# Altium schematic sheet Power and system. Page 5.SchDoc
size 420 x 297 mm; Address1: Address1; Address2: Address2; Address3: Address3; Address4: Address4; DocumentNumber: АБВГ.123456.001 Э3; SheetNumber: 5; SheetTotal: 5; Scale: 1:1; DocumentType: Схема электрическая принципиальная; FirstReferrence: АБВГ.123456.001
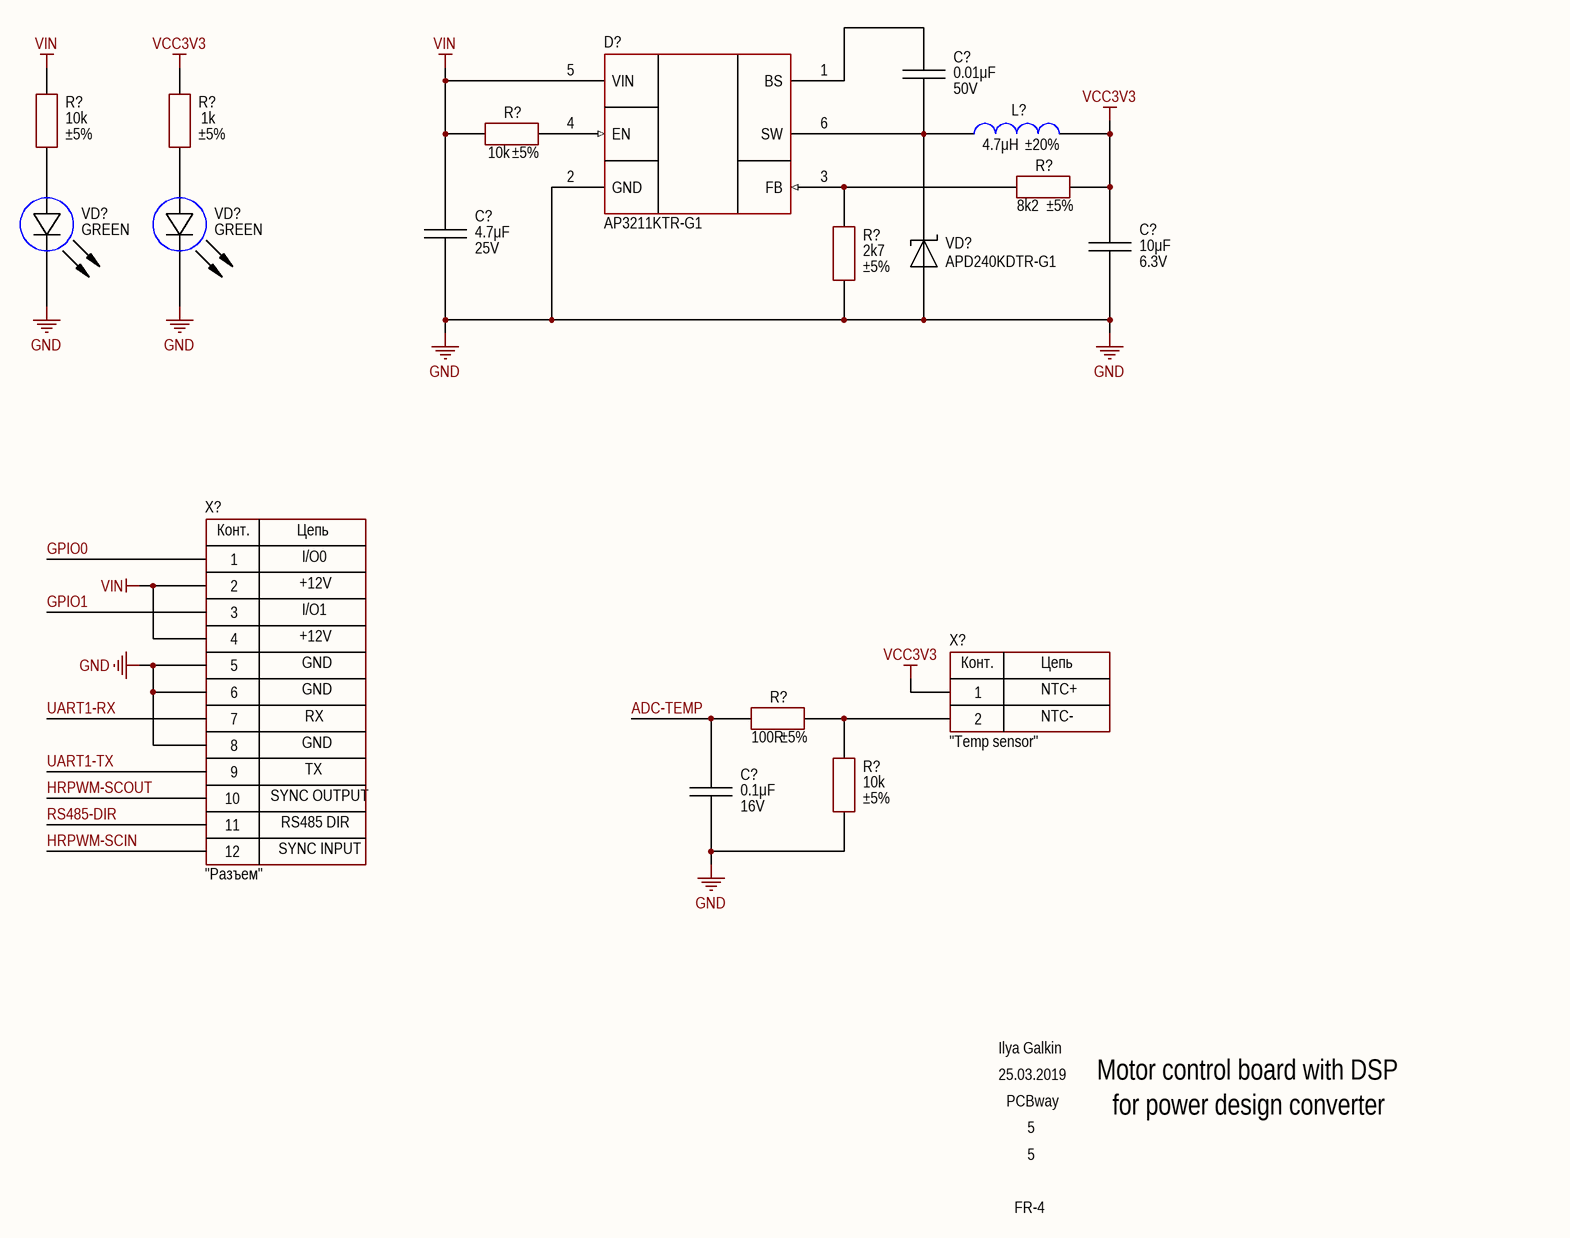
[diagram p0: Power and system. Page 5.SchDoc]

## Parts
(Parts that share a designator on the sheet are numbered #1, #2 ... from top to bottom, then left to right.)
C?#1  value 0.01μF  Voltage: 50V  [CAP: 0805]
C?#2  value 4.7μF  Voltage: 25V  [CAP: 0805]
C?#3  value 10μF  Voltage: 6.3V  [CAP: 0805]
C?#4  value 0.1μF  Voltage: 16V  [CAP: 0805]
D?  (no value)  [SOT23-6]
L?  value 4.7μH  Tolerance: ±20%  [IND: SRP2510A]
R?#1  value 10k  Tolerance: ±5%  [RES: 0805]
R?#2  value 10k  Tolerance: ±5%  [RES: 0805]
R?#3  value 1k  Tolerance: ±5%  [RES: 0805]
R?#4  value 8k2  Tolerance: ±5%  [RES: 0805]
R?#5  value 2k7  Tolerance: ±5%  [RES: 0805]
R?#6  value 100R  Tolerance: ±5%  [RES: 0805]
R?#7  value 10k  Tolerance: ±5%  [RES: 0805]
VD?#1  Color: GREEN  [LED: 0603G]
VD?#2  Color: GREEN  [LED: 0603G]
VD?#3  PartNumber: APD240KDTR-G1  [DIODE: SOD123]
X?#1  CommentText: "Разъем"  [CON: PBD-12]
X?#2  CommentText: "Temp sensor"  [CON: PLS-2]

## Nets
GND: C?#2.1 C?#3.1 C?#4.1 D?.2(GND) R?#5.1 R?#7.1 VD?#1.2(C) VD?#2.2(C) VD?#3.1 X?#1.5 X?#1.6 X?#1.8
VCC3V3: C?#3.2 L?.1 R?#3.2 R?#4.2 X?#2.1
VIN: C?#2.2 D?.5(VIN) R?#1.1 R?#2.2 X?#1.2 X?#1.4
ADC-TEMP: C?#4.2 R?#6.1
GPIO0: X?#1.1
GPIO1: X?#1.3
HRPWM-SCIN: X?#1.12
HRPWM-SCOUT: X?#1.10
RS485-DIR: X?#1.11
UART1-RX: X?#1.7
UART1-TX: X?#1.9
NetC?#1_1: C?#1.1 D?.6(SW) L?.2 VD?#3.2
NetC?#1_2: C?#1.2 D?.1(BS)
NetD?_3: D?.3(FB) R?#4.1 R?#5.2
NetD?_4: D?.4(EN) R?#1.2
NetR?#2_1: R?#2.1 VD?#1.1(A)
NetR?#3_1: R?#3.1 VD?#2.1(A)
NetR?#6_2: R?#6.2 R?#7.2 X?#2.2

## Notes on the sheet
- +12V
- I/O0
- GND
- I/O1
- RX
- NTC+
- NTC-
- SYNC OUTPUT
- TX
- SYNC INPUT
- RS485 DIR
- Ilya Galkin
- 25.03.2019
- PCBway
- 5
- Motor control board with DSP
- for power design converter
- FR-4
- Author
- Manufacturer
- Date
- Page
- Total pages
- Size page
- A3
- Open Hardware Project
- Materials
- (in symbol PBD-12) Конт.; Цепь
- (in symbol PLS-2) Конт.; Цепь

## Library data of the parts
C?#1 = Ceramic_0805: Manufacturer: Yageo; PartNumber: CC0805KRX7R9BB103; ValueManufacturerPartNumber: Ceramic capacitor, 0.01μF, X7R, ±10%, 50V, 0805, -55...+125°C; TypeCapacitor: Ceramic capacitor; Tolerance: ±10%; TypeDielectric: X7R; Package: 0805; HelpURL: https://www.digikey.com/product-detail/en/yageo/CC0805KRX7R9BB103/311-1136-1-ND/303046; Temperature: -55...+125°C
C?#2 = Ceramic_0805: Manufacturer: Samsung; PartNumber: CL21B475KAFNNNE; ValueManufacturerPartNumber: Ceramic capacitor, 4.7μF, X7R, ±10%, 25V, 0805, -55...+125°C; TypeCapacitor: Ceramic capacitor; Tolerance: ±10%; TypeDielectric: X7R; Package: 0805; HelpURL: https://www.digikey.com/product-detail/en/samsung-electro-mechanics/CL21B475KAFNNNE/1276-2969-1-ND/3891055; Temperature: -55...+125°C
C?#3 = Ceramic_0805: Manufacturer: Samsung; PartNumber: CL21B106KQQNNNE; ValueManufacturerPartNumber: Ceramic capacitor, 10μF, X7R, ±10%, 6.3V, 0805, -55...+125°C; TypeCapacitor: Ceramic capacitor; Tolerance: ±10%; TypeDielectric: X7R; Package: 0805; HelpURL: https://www.digikey.com/product-detail/en/samsung-electro-mechanics/CL21B106KQQNNNE/1276-1113-1-ND/3889199; Temperature: -55...+125°C
C?#4 = Ceramic_0805: Manufacturer: Yageo; PartNumber: CC0805KRX7R7BB104; ValueManufacturerPartNumber: Ceramic capacitor, 0.1μF, X7R, ±10%, 16V, 0805, -55...+125°C; TypeCapacitor: Ceramic capacitor; Tolerance: ±10%; TypeDielectric: X7R; Package: 0805; HelpURL: https://www.digikey.com/product-detail/en/yageo/CC0805KRX7R7BB104/311-1142-1-ND/303052; Temperature: -55...+125°C
D? = AP3211KTR-G1: Buck converter; Manufacturer: Diodes Incorporated; ValueManufacturerPartNumber: DC/DC buck converter, input 4.5...18V, 1.4MHz, output 0.81...15V, 1.5A, -40...+85°C, SOT23-6; VoltageInput: input 4.5...18V; Frequency: 1.4MHz; CurrentOutput: 1.5A; VoltageOutput: output 0.81...15V; HelpURL: https://www.digikey.com/product-detail/en/diodes-incorporated/AP3211KTR-G1/AP3211KTR-G1DICT-ND/4505305; Package: SOT23-6; ComponentType: DC/DC buck converter; Temperature: -40...+85°C; PartNumber: AP3211KTR-G1
L? = Inductor_SRP2510A: Manufacturer: Bourns; PartNumber: SRP2510A-4R7M; ValueManufacturerPartNumber: Fixed inductor, 4.7μH, ±20%, SRP2510A, 1.36A, -40...+125°C; TypeInductor: Fixed inductor; MaxCurrent: 1.36A; Package: SRP2510A; HelpURL: https://www.digikey.com/product-detail/en/bourns-inc/SRP2510A-4R7M/SRP2510A-4R7MCT-ND/7354840; Temperature: -40...+125°C
R?#1 R?#2 R?#7 = Resistor_0805: Manufacturer: Yageo; PartNumber: RC0805JR-0710KL; ValueManufacturerPartNumber: Resistor film, 10k, ±5%, 0805, 0.125W, -55...+125°C; TypeResistor: Resistor film; Power: 0.125W; Package: 0805; HelpURL: https://www.digikey.com/product-detail/en/yageo/RC0805JR-0710KL/311-10KARCT-ND/731188; Temperature: -55...+125°C
R?#3 = Resistor_0805: Manufacturer: Yageo; PartNumber: RC0805JR-071KL; ValueManufacturerPartNumber: Resistor film, 1k, ±5%, 0805, 0.125W, -55...+125°C; TypeResistor: Resistor film; Power: 0.125W; Package: 0805; HelpURL: https://www.digikey.com/product-detail/en/yageo/RC0805JR-071KL/311-1.0KARCT-ND/731165; Temperature: -55...+125°C
R?#4 = Resistor_0805: Manufacturer: Yageo; PartNumber: RC0805JR-078K2L; ValueManufacturerPartNumber: Resistor film, 8k2, ±5%, 0805, 0.125W, -55...+125°C; TypeResistor: Resistor film; Power: 0.125W; Package: 0805; HelpURL: https://www.digikey.com/product-detail/en/yageo/RC0805JR-078K2L/311-8.2KARCT-ND/731320; Temperature: -55...+125°C
R?#5 = Resistor_0805: Manufacturer: Yageo; PartNumber: RC0805JR-072K7L; ValueManufacturerPartNumber: Resistor film, 2k7, ±5%, 0805, 0.125W, -55...+125°C; TypeResistor: Resistor film; Power: 0.125W; Package: 0805; HelpURL: https://www.digikey.com/product-detail/en/yageo/RC0805JR-072K7L/311-2.7KARCT-ND/731224; Temperature: -55...+125°C
R?#6 = Resistor_0805: Manufacturer: Yageo; PartNumber: RC0805JR-07100RL; ValueManufacturerPartNumber: Resistor film, 100R, ±5%, 0805, 0.125W, -55...+125°C; TypeResistor: Resistor film; Power: 0.125W; Package: 0805; HelpURL: https://www.digikey.com/product-detail/en/yageo/RC0805JR-07100RL/311-100ARCT-ND/731185; Temperature: -55...+125°C
VD?#1 VD?#2 = LED_single: ValueManufacturerPartNumber: LED, *, *, *, -55...+150°C; TypeDiode: LED; Manufacturer: *; Package: *; HelpURL: *; Temperature: -55...+150°C; Current: *; VoltageDrop: *; PartNumber: *
VD?#3 = Schottky_single: Manufacturer: Diodes Incorporated; ValueManufacturerPartNumber: Schottky diode, 40V, 2A, 500mV, 15pF, SOD-123, -55...+150°C; TypeDiode: Schottky diode; Voltage: 40V; Current: 2A; VoltageDrop: 500mV; RecoveryTime: 15pF; Package: SOD-123; HelpURL: https://www.digikey.com/product-detail/en/diodes-incorporated/APD240KDTR-G1/APD240KDTR-G1DICT-ND/7708824; Temperature: -55...+150°C
X?#1 = PBD-12: Manufacturer: Connfly; ValueManufacturerPartNumber: Connector, 12pin, 2.54mm, 500VAC, 3A; TypeConnector: Connector; VoltageMax: 500VAC; Pitch: 2.54mm; CurrentMax: 3A; Multichannel: 12pin; HelpURL: https://www.chipdip.ru/product/pbd-12; PartNumber: PBD-12
X?#2 = PLS-2: Manufacturer: Connfly; ValueManufacturerPartNumber: Connector, 2pin, 2.54mm, 500VAC, 3A; TypeConnector: Connector; VoltageMax: 500VAC; Pitch: 2.54mm; CurrentMax: 3A; Multichannel: 2pin; HelpURL: https://www.chipdip.ru/product/pls-2; PartNumber: PLS-2